# Altium schematic sheet Main.SchDoc
size A4
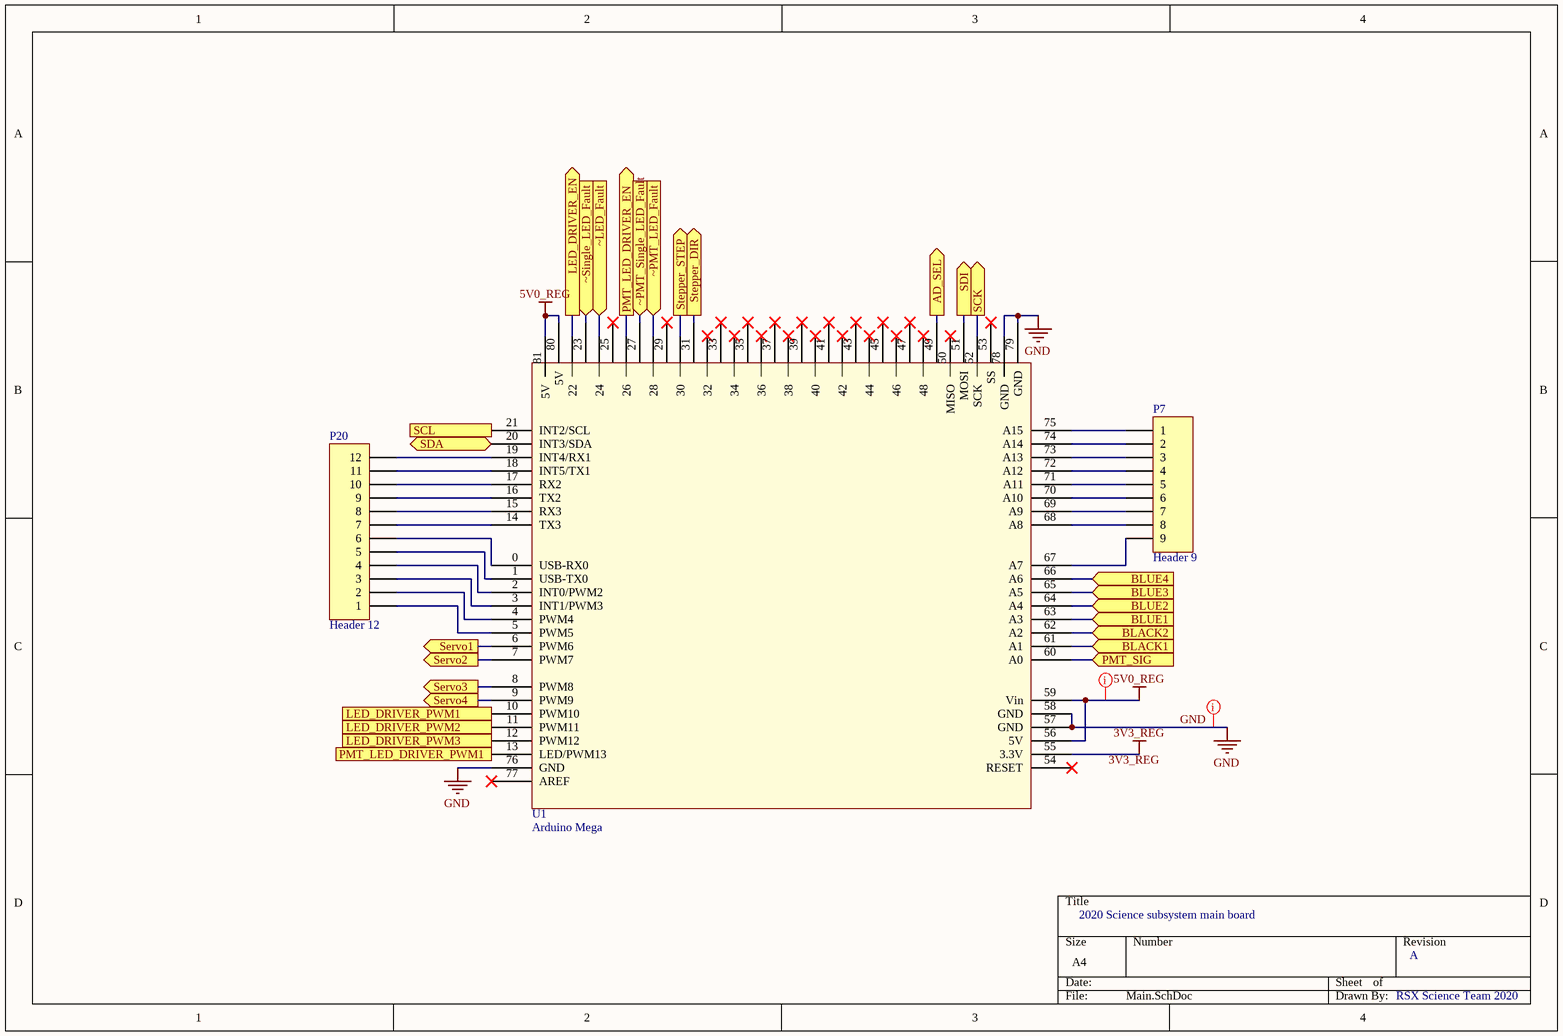
[diagram p0: Main.SchDoc]

## Parts
P7  Header 9  [HDR1X9]
P20  Header 12  [HDR1X12]
U1  Arduino Mega  [Arduino Mega]

## Ports
AD_SEL (out), BLACK1 (in), BLACK2 (in), BLUE1 (in), BLUE2 (in), BLUE3 (in), BLUE4 (in), LED_DRIVER_EN (out), LED_DRIVER_PWM1 (out), LED_DRIVER_PWM2 (out), LED_DRIVER_PWM3 (out), PMT_LED_DRIVER_EN (out), PMT_LED_DRIVER_PWM1 (out), PMT_SIG (in), SCK (out), SCL (out), SDA (bidir), SDI (out), Servo1 (out), Servo2 (out), Servo3 (out), Servo4 (out), Stepper_DIR (out), Stepper_STEP (out), ~LED_Fault (in), ~PMT_LED_Fault (in), ~PMT_Single_LED_Fault (in), ~Single_LED_Fault (in)

## Nets
3V3_REG: U1.55(3.3V)
5V0_REG: U1.56(5V) U1.59(Vin) U1.80(5V) U1.81(5V)
GND: U1.57(GND) U1.58(GND) U1.76(GND) U1.78(GND) U1.79(GND)
AD_SEL: U1.49 ; port AD_SEL
BLACK1: U1.61(A1) ; port BLACK1
BLACK2: U1.62(A2) ; port BLACK2
BLUE1: U1.63(A3) ; port BLUE1
BLUE2: U1.64(A4) ; port BLUE2
BLUE3: U1.65(A5) ; port BLUE3
BLUE4: U1.66(A6) ; port BLUE4
LED_DRIVER_EN: U1.22 ; port LED_DRIVER_EN
LED_DRIVER_PWM1: U1.10(PWM10) ; port LED_DRIVER_PWM1
LED_DRIVER_PWM2: U1.11(PWM11) ; port LED_DRIVER_PWM2
LED_DRIVER_PWM3: U1.12(PWM12) ; port LED_DRIVER_PWM3
PMT_LED_DRIVER_EN: U1.26 ; port PMT_LED_DRIVER_EN
PMT_LED_DRIVER_PWM1: U1.13(LED/PWM13) ; port PMT_LED_DRIVER_PWM1
PMT_SIG: U1.60(A0) ; port PMT_SIG
SCK: U1.52(SCK) ; port SCK
SCL: U1.21(INT2/SCL) ; port SCL
SDA: U1.20(INT3/SDA) ; port SDA
SDI: U1.51(MOSI) ; port SDI
Servo1: U1.6(PWM6) ; port Servo1
Servo2: U1.7(PWM7) ; port Servo2
Servo3: U1.8(PWM8) ; port Servo3
Servo4: U1.9(PWM9) ; port Servo4
Stepper_DIR: U1.31 ; port Stepper_DIR
Stepper_STEP: U1.30 ; port Stepper_STEP
~LED_Fault: U1.24 ; port ~LED_Fault
~PMT_LED_Fault: U1.28 ; port ~PMT_LED_Fault
~PMT_Single_LED_Fault: U1.27 ; port ~PMT_Single_LED_Fault
~Single_LED_Fault: U1.23 ; port ~Single_LED_Fault
NetP7_1: P7.1 U1.75(A15)
NetP7_2: P7.2 U1.74(A14)
NetP7_3: P7.3 U1.73(A13)
NetP7_4: P7.4 U1.72(A12)
NetP7_5: P7.5 U1.71(A11)
NetP7_6: P7.6 U1.70(A10)
NetP7_7: P7.7 U1.69(A9)
NetP7_8: P7.8 U1.68(A8)
NetP7_9: P7.9 U1.67(A7)
NetP20_1: P20.1 U1.5(PWM5)
NetP20_2: P20.2 U1.4(PWM4)
NetP20_3: P20.3 U1.3(INT1/PWM3)
NetP20_4: P20.4 U1.2(INT0/PWM2)
NetP20_5: P20.5 U1.1(USB-TX0)
NetP20_6: P20.6 U1.0(USB-RX0)
NetP20_7: P20.7 U1.14(TX3)
NetP20_8: P20.8 U1.15(RX3)
NetP20_9: P20.9 U1.16(TX2)
NetP20_10: P20.10 U1.17(RX2)
NetP20_11: P20.11 U1.18(INT5/TX1)
NetP20_12: P20.12 U1.19(INT4/RX1)

Not connected (* = marked no-connect by the designer): U1 25* 29* 32* 33* 34* 35* 36* 37* 38* 39* 40* 41* 42* 43* 44* 45* 46* 47* 48* 50(MISO)* 53(SS)* 54(RESET)* 77(AREF)*

## Layout directives
rule Width Constraint [Pref Width = 15mil    Min Width = 15mil    Max Width = 15mil]: 5V0_REG, GND

## Notes on the sheet
- 2020 Science subsystem main board
- A
- RSX Science Team 2020
- Labels drawn without touching a wire or pin: 3V3_REG

## Library data of the parts
P7 = Header 9: Header, 9-Pin; LatestRevisionDate: 17-Jul-2002; LatestRevisionNote: Re-released for DXP Platform.; Publisher: Altium Limited
P20 = Header 12: Header, 12-Pin; LatestRevisionDate: 17-Jul-2002; LatestRevisionNote: Re-released for DXP Platform.; Publisher: Altium Limited